# EAGLE design potentiometer (EAGLE 9.5.0)
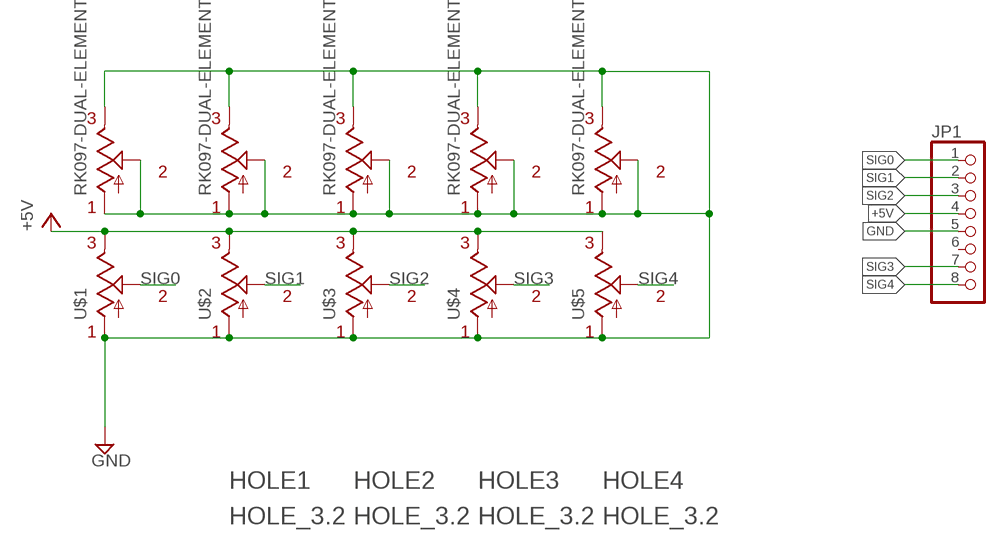
[diagram p0: schematic, sheet 1]

## Parts
HOLE1  HOLE_3.2  [HOLE_3.2]
HOLE2  HOLE_3.2  [HOLE_3.2]
HOLE3  HOLE_3.2  [HOLE_3.2]
HOLE4  HOLE_3.2  [HOLE_3.2]
JP1  PINHD-1X8  [1X08]
U$1  RK097-DUAL-ELEMENT  [RK097-DUAL-ELEMENT]
U$2  RK097-DUAL-ELEMENT  [RK097-DUAL-ELEMENT]
U$3  RK097-DUAL-ELEMENT  [RK097-DUAL-ELEMENT]
U$4  RK097-DUAL-ELEMENT  [RK097-DUAL-ELEMENT]
U$5  RK097-DUAL-ELEMENT  [RK097-DUAL-ELEMENT]

## Nets
+5V: JP1.4 U$1.P$4(E1) U$2.P$4(E1) U$3.P$4(E1) U$4.P$4(E1) U$5.P$4(E1)
GND: JP1.5 U$1.P$1(A) U$1.P$2(A1) U$1.P$3(E) U$1.P$5(S) U$2.P$1(A) U$2.P$2(A1) U$2.P$3(E) U$2.P$5(S) U$3.P$1(A) U$3.P$2(A1) U$3.P$3(E) U$3.P$5(S) U$4.P$1(A) U$4.P$2(A1) U$4.P$3(E) U$4.P$5(S) U$5.P$1(A) U$5.P$2(A1) U$5.P$3(E) U$5.P$5(S)
SIG0: JP1.1 U$1.P$6(S1)
SIG1: JP1.2 U$2.P$6(S1)
SIG2: JP1.3 U$3.P$6(S1)
SIG3: JP1.7 U$4.P$6(S1)
SIG4: JP1.8 U$5.P$6(S1)
Unconnected: JP1.6

## Library data of the parts
HOLE1-HOLE4 = Document_Robotech:HOLE_3.2: Robotech hole diameter 3.2mm tDoc washer(diameter 8mm) bDoc spacer(diameter 6mm)
JP1 = Connector_Robotech:PINHD-1X8: PIN HEADER
U$1-U$5 = alps_japan_potentiometers:RK097-DUAL-ELEMENT: SCHEMATIC FOR DUAL POTENTIOMETER

## Board
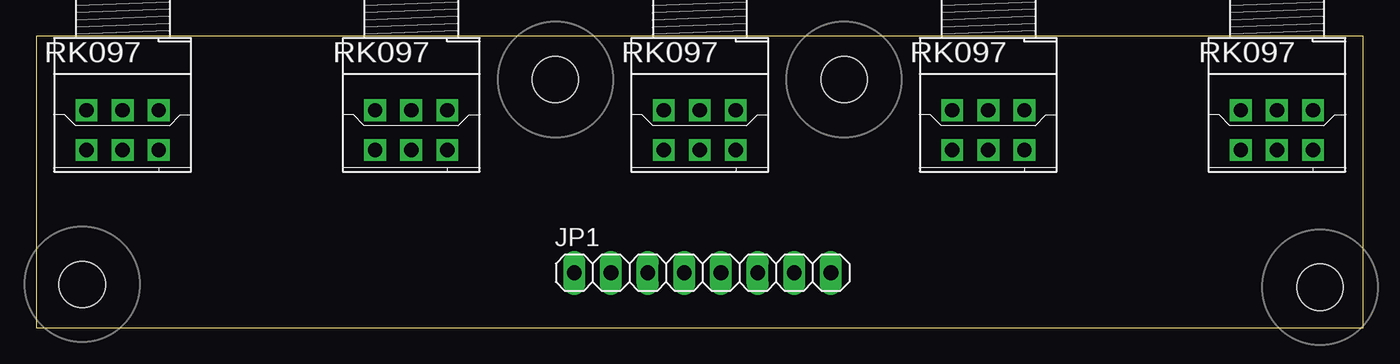
[diagram p1: board, top side]
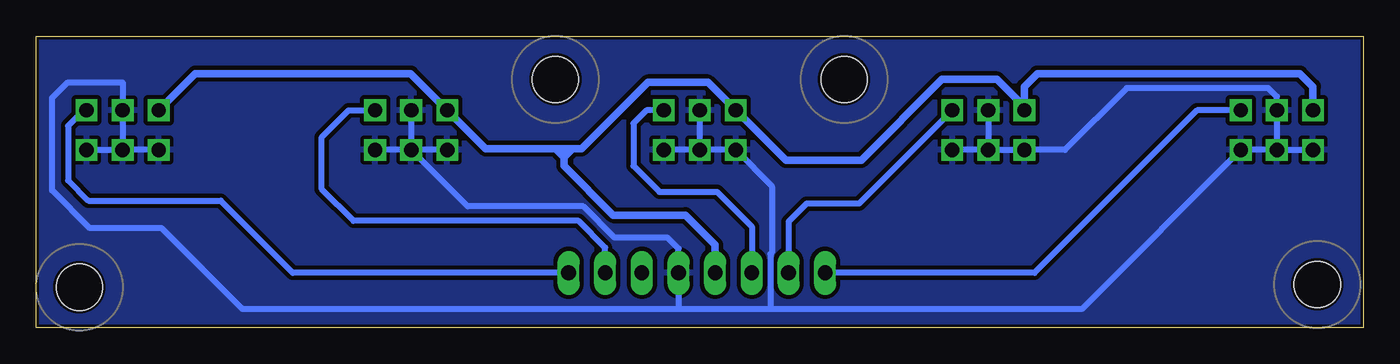
[diagram p2: board, bottom side, seen from below]

Size 92 x 20.2 mm. Coordinates in mm from the lower left corner, seen from the top.
Outline: 0,0 92,0 92,20.2 0,20.2 0,0
Copper layers (1*16): Top 0.0356mm / dielectric 1.5011mm / Bottom 0.0356mm
Design rules "formita": minimum track width 10mil, minimum drill 0.5994mm, track to track 0.3mm, track to pad 0.3mm, pad to pad 0.3mm, via to via 0.3mm, smd to smd 8mil, copper to edge 8mil, drill to drill 8mil, minimum pad ring 10mil, minimum via ring 8mil, stop-mask expansion 4mil, vias tented up to drill 1mm, thermal gap 10mil

### Footprints (pad centres in the part's own frame; a part is rotated, then mirrored left to right if it is on the bottom)
HOLE_3.2 = hole 3.2: 0,0
1X08 = drill 1.016 long: 1 -8.89,0; 2 -6.35,0; 3 -3.81,0; 4 -1.27,0; 5 1.27,0; 6 3.81,0; 7 6.35,0; 8 8.89,0
RK097-DUAL-ELEMENT = drill 1 pad 1.422 square: P$1 -2.5,2.69; P$2 0,2.69; P$3 2.5,2.69; P$4 2.5,-0.06; P$5 0,-0.06; P$6 -2.5,-0.06

### Placement (x,y rotation side)
HOLE1  3.2,3 0 top
HOLE2  89,2.8 0 top
HOLE3  36,17.2 0 top
HOLE4  56,17.2 0 top
JP1  46.2,3.8 0 top
U$1  6,15 180 top
U$2  26,15 180 top
U$3  46,15 180 top
U$4  66,15 180 top
U$5  86,15 180 top

### Tracks (layer width: path | path; a pad name or v marks a point on that pad's centre or on a via)
+5V
  Bottom 0.508: U$1.P$4 3.5,16.7 4.4,17.6 22.6,17.6 23.5,16.7 U$2.P$4 23.5,15.3 25.4,17.2 29.2,17.2 34.8,11.6 40.04,11.6 U$3.P$4 45.44,17 49.6,17 54.2,12.4 54.8,12.4 | 54.8,12.4 55.4,12.4 | 55.4,12.4 56,12.4 | 56,12.4 60.84,12.4 U$4.P$4 66.04,17.6 80.96,17.6 U$5.P$4 | 55.4,12.4 55.4,11.8 | 55.4,11.8 55.4,11.2 52,7.8 47,7.8 44.93,5.73 JP1.4 | 54.8,12.4 55.4,11.8 | 55.4,11.8 56,12.4
GND
  Bottom 0.406: U$5.P$2 U$5.P$5 86,17 89.8,17 90.89,15.91 90.89,9.51 88.27,6.89 83.29,6.89 77.69,1.28 47.47,1.28 | U$5.P$1 U$5.P$2 | U$3.P$2 U$3.P$5 | U$3.P$2 U$3.P$1 | U$4.P$5 U$4.P$2 | U$4.P$2 U$4.P$1 | U$2.P$5 U$2.P$2 | U$2.P$2 U$2.P$1 | U$1.P$2 U$1.P$5 6,16 6.6,16.6 16.4,16.6 20.69,12.31 U$2.P$3 U$2.P$2 | U$1.P$2 U$1.P$1 19.52,1.28 41.12,1.28 | U$4.P$2 62.09,8.4 54.07,8.4 51.91,6.24 48.24,6.24 47.47,5.47 JP1.5 47.47,1.28 | U$1.P$2 U$1.P$3 | U$4.P$3 U$4.P$2 | U$3.P$2 U$3.P$3 41,9.81 41,5.2 41.12,5.09 41.12,1.28 | 41.12,1.28 47.47,1.28 | U$5.P$3 U$5.P$2
  pour Bottom: 0,20.2 0,0 92,0 92,20.2
SIG0
  Bottom 0.406: U$1.P$6 11.54,15.06 22.8,3.8 JP1.1
SIG1
  Bottom 0.406: U$2.P$6 34.96,8.6 38.6,8.6 39.85,7.35 JP1.2
SIG2
  Bottom 0.406: U$3.P$6 49.7,15.06 50.6,14.16 50.6,11.2 48.8,9.4 44.8,9.4 42.39,6.99 JP1.3
SIG3
  Bottom 0.406: U$4.P$6 70.34,15.06 72.2,13.2 72.2,9.6 70,7.4 54.4,7.4 52.55,5.55 JP1.7
SIG4
  Bottom 0.406: U$5.P$6 88.7,15.06 89.78,13.98 89.78,10.2 88.38,8.8 79.2,8.8 74.2,3.8 JP1.8